# Altium schematic sheet Actel_CoreMP7_UART.SchDoc
size B; DocumentNumber: 1; SheetNumber: 1; SheetTotal: 1
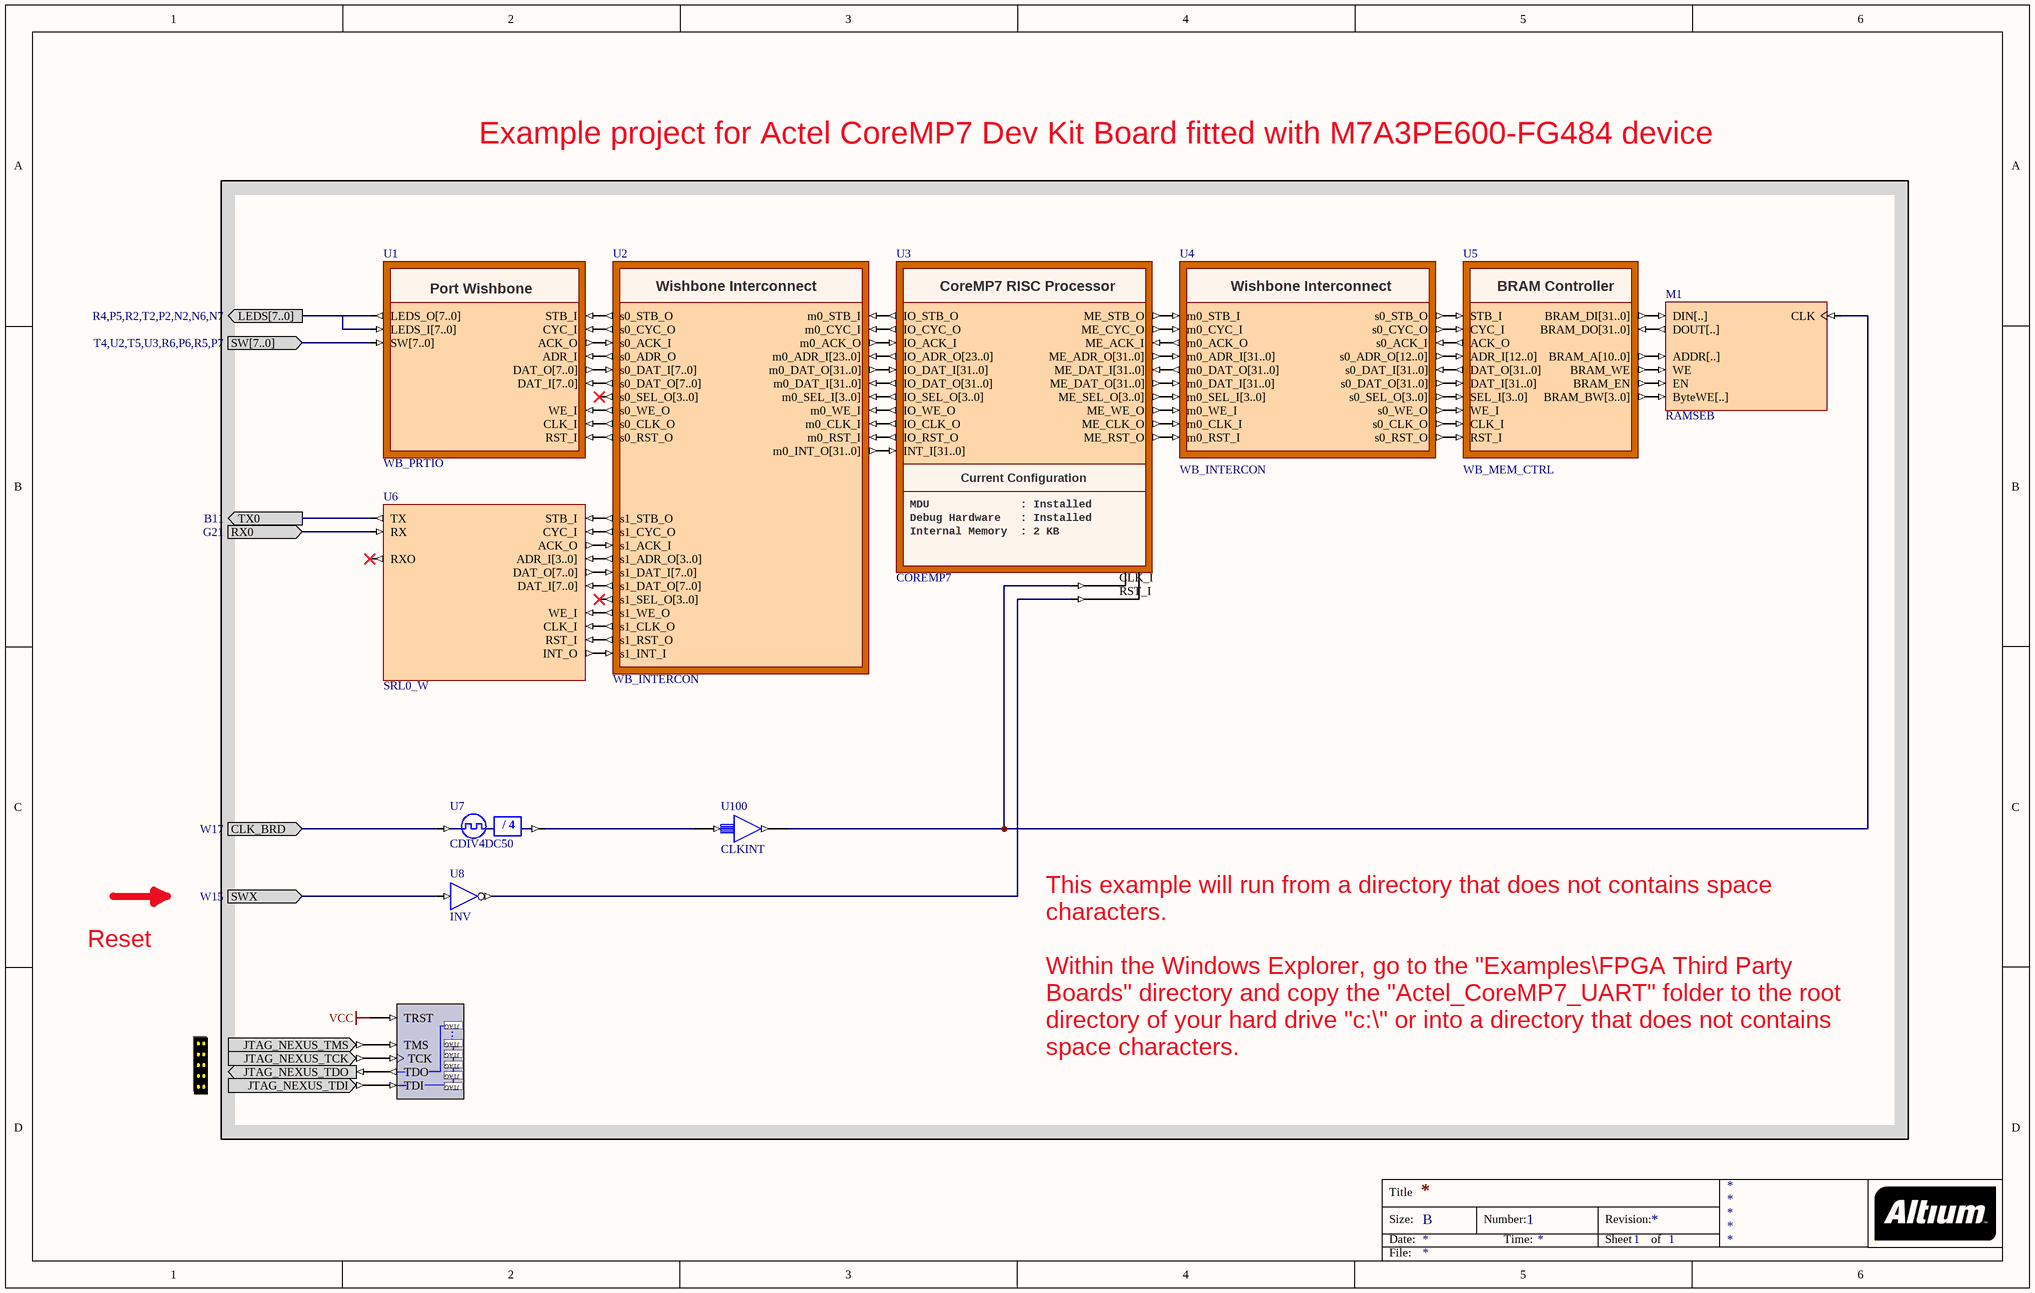
[diagram p0: Actel_CoreMP7_UART.SchDoc]

## Parts
?  NEXUS_JTAG_CONNECTOR  (value not drawn)
M1  RAMSEB
NEXUS_JTAG_PORT  NEXUS_JTAG_PORT  (value not drawn)
U1  WB_PRTIO
U2  WB_INTERCON
U3  COREMP7
U4  WB_INTERCON
U5  WB_MEM_CTRL
U6  SRL0_W
U7  CDIV4DC50
U8  INV
U100  CLKINT

## Ports
CLK_BRD (in, see W17), LEDS[7..0] (out, see R4,P5,R2,T2,P2,N2,N6,N7), RX0 (in, see G21), SW[7..0] (in, see T4,U2,T5,U3,R6,P6,R5,P7), SWX (in, see W15), TX0 (out, see B11)

## Nets
VCC: NEXUS_JTAG_PORT.TRST
CLK_BRD: U7.CLKIN ; port CLK_BRD
LEDS[7..0]: U1.LEDS_I[7..0] U1.LEDS_O[7..0] ; port LEDS[7..0]
RX0: U6.RX ; port RX0
SW[7..0]: U1.SW[7..0] ; port SW[7..0]
SWX: U8.I ; port SWX
TX0: U6.TX ; port TX0
Net?_JTAG_NEXUS_TCK: ?.JTAG_NEXUS_TCK NEXUS_JTAG_PORT.TCK
Net?_JTAG_NEXUS_TDI: ?.JTAG_NEXUS_TDI NEXUS_JTAG_PORT.TDI
Net?_JTAG_NEXUS_TDO: ?.JTAG_NEXUS_TDO NEXUS_JTAG_PORT.TDO
Net?_JTAG_NEXUS_TMS: ?.JTAG_NEXUS_TMS NEXUS_JTAG_PORT.TMS
NetM1_ADDR[..]: M1.ADDR[..] U5.BRAM_A[10..0]
NetM1_ByteWE[..]: M1.ByteWE[..] U5.BRAM_BW[3..0]
NetM1_CLK: M1.CLK U3.CLK_I U100.Y
NetM1_DIN[..]: M1.DIN[..] U5.BRAM_DI[31..0]
NetM1_DOUT[..]: M1.DOUT[..] U5.BRAM_DO[31..0]
NetM1_EN: M1.EN U5.BRAM_EN
NetM1_WE: M1.WE U5.BRAM_WE
NetU1_ACK_O: U1.ACK_O U2.s0_ACK_I
NetU1_ADR_I: U1.ADR_I U2.s0_ADR_O
NetU1_CLK_I: U1.CLK_I U2.s0_CLK_O
NetU1_CYC_I: U1.CYC_I U2.s0_CYC_O
NetU1_DAT_I[7..0]: U1.DAT_I[7..0] U2.s0_DAT_O[7..0]
NetU1_DAT_O[7..0]: U1.DAT_O[7..0] U2.s0_DAT_I[7..0]
NetU1_RST_I: U1.RST_I U2.s0_RST_O
NetU1_STB_I: U1.STB_I U2.s0_STB_O
NetU1_WE_I: U1.WE_I U2.s0_WE_O
NetU2_m0_ACK_O: U2.m0_ACK_O U3.IO_ACK_I
NetU2_m0_ADR_I[23..0]: U2.m0_ADR_I[23..0] U3.IO_ADR_O[23..0]
NetU2_m0_CLK_I: U2.m0_CLK_I U3.IO_CLK_O
NetU2_m0_CYC_I: U2.m0_CYC_I U3.IO_CYC_O
NetU2_m0_DAT_I[31..0]: U2.m0_DAT_I[31..0] U3.IO_DAT_O[31..0]
NetU2_m0_DAT_O[31..0]: U2.m0_DAT_O[31..0] U3.IO_DAT_I[31..0]
NetU2_m0_INT_O[31..0]: U2.m0_INT_O[31..0] U3.INT_I[31..0]
NetU2_m0_RST_I: U2.m0_RST_I U3.IO_RST_O
NetU2_m0_SEL_I[3..0]: U2.m0_SEL_I[3..0] U3.IO_SEL_O[3..0]
NetU2_m0_STB_I: U2.m0_STB_I U3.IO_STB_O
NetU2_m0_WE_I: U2.m0_WE_I U3.IO_WE_O
NetU2_s1_ACK_I: U2.s1_ACK_I U6.ACK_O
NetU2_s1_ADR_O[3..0]: U2.s1_ADR_O[3..0] U6.ADR_I[3..0]
NetU2_s1_CLK_O: U2.s1_CLK_O U6.CLK_I
NetU2_s1_CYC_O: U2.s1_CYC_O U6.CYC_I
NetU2_s1_DAT_I[7..0]: U2.s1_DAT_I[7..0] U6.DAT_O[7..0]
NetU2_s1_DAT_O[7..0]: U2.s1_DAT_O[7..0] U6.DAT_I[7..0]
NetU2_s1_INT_I: U2.s1_INT_I U6.INT_O
NetU2_s1_RST_O: U2.s1_RST_O U6.RST_I
NetU2_s1_STB_O: U2.s1_STB_O U6.STB_I
NetU2_s1_WE_O: U2.s1_WE_O U6.WE_I
NetU3_ME_ACK_I: U3.ME_ACK_I U4.m0_ACK_O
NetU3_ME_ADR_O[31..0]: U3.ME_ADR_O[31..0] U4.m0_ADR_I[31..0]
NetU3_ME_CLK_O: U3.ME_CLK_O U4.m0_CLK_I
NetU3_ME_CYC_O: U3.ME_CYC_O U4.m0_CYC_I
NetU3_ME_DAT_I[31..0]: U3.ME_DAT_I[31..0] U4.m0_DAT_O[31..0]
NetU3_ME_DAT_O[31..0]: U3.ME_DAT_O[31..0] U4.m0_DAT_I[31..0]
NetU3_ME_RST_O: U3.ME_RST_O U4.m0_RST_I
NetU3_ME_SEL_O[3..0]: U3.ME_SEL_O[3..0] U4.m0_SEL_I[3..0]
NetU3_ME_STB_O: U3.ME_STB_O U4.m0_STB_I
NetU3_ME_WE_O: U3.ME_WE_O U4.m0_WE_I
NetU3_RST_I: U3.RST_I U8.O
NetU4_s0_ACK_I: U4.s0_ACK_I U5.ACK_O
NetU4_s0_ADR_O[12..0]: U4.s0_ADR_O[12..0] U5.ADR_I[12..0]
NetU4_s0_CLK_O: U4.s0_CLK_O U5.CLK_I
NetU4_s0_CYC_O: U4.s0_CYC_O U5.CYC_I
NetU4_s0_DAT_I[31..0]: U4.s0_DAT_I[31..0] U5.DAT_O[31..0]
NetU4_s0_DAT_O[31..0]: U4.s0_DAT_O[31..0] U5.DAT_I[31..0]
NetU4_s0_RST_O: U4.s0_RST_O U5.RST_I
NetU4_s0_SEL_O[3..0]: U4.s0_SEL_O[3..0] U5.SEL_I[3..0]
NetU4_s0_STB_O: U4.s0_STB_O U5.STB_I
NetU4_s0_WE_O: U4.s0_WE_O U5.WE_I
NetU7_CLKDV: U7.CLKDV U100.A

Not connected (* = marked no-connect by the designer): U2 s0_SEL_O[3..0]* s1_SEL_O[3..0]*; U6 RXO*

## Notes on the sheet
- Example project for Actel CoreMP7 Dev Kit Board fitted with M7A3PE600-FG484 device
- Reset
- This example will run from a directory that does not contains space characters.
  Within the Windows Explorer, go to the "Examples\FPGA Third Party Boards" directory and copy the "Actel_CoreMP7_UART" folder to the root directory of your hard drive "c:\" or into a directory that does not contains space characters.
- Title
- Size:
- Date:
- B
- Number:
- Time:
- Revision:
- Sheet
- of
- File:
- (in symbol CDIV4DC50) / 4
- (in symbol COREMP7) Current Configuration; MDU              : Installed; Debug Hardware   : Installed; Internal Memory  : 2 KB
- (in symbol NEXUS_JTAG_PORT) .
- (in symbol WB_INTERCON) Wishbone Interconnect
- (in symbol WB_MEM_CTRL) BRAM Controller
- (in symbol WB_PRTIO) Port Wishbone

## Library data of the parts
? = NEXUS_JTAG_CONNECTOR: JTAG Port; PortComponent: True; Published: 19-Nov-2003; Publisher: Altium Limited; HelpURL: TR0102 NanoBoard Technical Reference Manual - NB1.pdf#page=33
M1 = RAMSEB: Single Port Random Access Memory With Enable, Byte Write Enable; Memory_Depth: DefinedBy=ADDR; Memory_Type: RAM_SinglePortBlock; Memory_Width: DefinedBy=DIN; Memory_ClockEdge: Rising; Nexus_Core: Memory_Program; Memory_EnablePin: True; SubClass: RAM; Published: 12-Jan-2005; Publisher: Altium Limited; LastRevisionNo: 1.00.00; HelpURL: CR0118 FPGA Generic Library Guide.pdf#page=419; FunctionalClass: Memory; Memory_ByteWrites: True
NEXUS_JTAG_PORT = NEXUS_JTAG_PORT: Soft Nexus-Chain Connector; NEXUS_JTAG_CONNECTOR: True; FunctionalClass: JTAG; Published: 29-Jan-2004; Publisher: Altium Limited; LastRevisionNo: 1.00.00; HelpURL: CR0118 FPGA Generic Library Guide.pdf#page=405
U1 = WB_PRTIO: Configurable Port Wishbone; ConfigurationParameters: {}Version[2.0]{}Signal0Name[LEDS_]{}Signal0Type[In/Out]{}Signal0BusString[{1}7..0{2}]{}Signal0Address[0]{}Signal0SpaceAfter[0]{}Signal1Name[SW]{}Signal1Type[In]{}Signal1BusString[{1}7..0{2}]{}Signal1Address[1]{}Signal1SpaceAfter[0]{}; ComponentLink1Description: Core &Resource Usage; ComponentLink1URL: CR0139 FPGA Peripheral Resource Usage.pdf#page=74; HelpURL: CR0154 WB_PRTIO Configurable Wishbone Parallel Port Unit.pdf; LastRevisionNo: 1.00.00; Published: 9-Dec-2004; Publisher: Altium Limited; ConfiguratorName: WB_PRTIO
U2 = WB_INTERCON: Configurable Wishbone Interconnect; ConfigurationParameters: {}Version[1.0]{}UnusedInterrupts[1]{}MasterAddressBits[1]{}Name0[GPIO]{}Kind0[0]{}SpaceAfter0[5]{}Address_Base0[0]{}Address_Bits0[1]{}Address_Mode0[1]{}Address_DecodeWidth0[8]{}DataWidth0[2]{}UsedInterrupts0[ ]{}Name1[UART]{}Kind1[0]{}SpaceAfter1[4]{}Address_Base1[1048576]{}Address_Bits1[4]{}Address_Mode1[1]{}Address_DecodeWidth1[8]{}DataWidth1[2]{}UsedInterrupts1[0]; ComponentLink1Description: Core &Resource Usage; ComponentLink1URL: CR0139 FPGA Peripheral Resource Usage.pdf#page=56; HelpURL: CR0150 WB_INTERCON Configurable Wishbone Interconnect.pdf; LastRevisionNo: 1.00.00; Published: 9-Dec-2004; Publisher: Altium Limited; ConfiguratorName: WB_INTERCON
U3 = COREMP7: CoreMP7 RISC Processor; Nexus_JTAG_Device: True; Nexus_Core: Processor_OCDS; Nexus_JTAG_Order: 0; ConfigurationParameters: {}Version[1.0]{}Option_Processor[8]{}Option_Memory[1]{}Option_MDU[0]{}Option_OCDS[0]{}Option_Shifter[0]{}Option_InterruptCount[32]{}Option_DebugWhenReset[0]{}; ConfiguratorName: FPGA_MCU32; Memory_Configuration: Record[PERIPHERAL]{}ComponentDesignator[GPIO]{}Memory_Depth[0x0002]{}Memory_UsageType[peripheral]{}ProgramDownloadAddress[0xFF000000]{}Memory_BusType[ARM:local_bus]{}Memory_Mau[8]{}Memory_MatchedComponent[]{}Memory_Description[U2]{}Memory_FillBitPattern[]{}Memory_Interrupts[]{n}Record[PERIPHERAL]{}ComponentDesignator[UART]{}Memory_Depth[0x0010]{}Memory_UsageType[peripheral]{}ProgramDownloadAddress[0xFF100000]{}Memory_BusType[ARM:local_bus]{}Memory_Mau[8]{}Memory_MatchedComponent[]{}Memory_Description[U2]{}Memory_FillBitPattern[]{}Memory_Interrupts[0]{n}Record[CODE_EXPORT]{}ExportType[1]{n}Record[NEXUS_CORE]{}ComponentDesignator[irom]{}Memory_Depth[2k]{}Memory_UsageType[rom]{}ProgramDownloadAddress[0x00000000]{}Memory_BusType[ARM:local_bus]{}Memory_Mau[8]{}Memory_MatchedComponent[]{}Memory_Description[]{}Memory_FillBitPattern[]{}Memory_Interrupts[]{n}Record[NEXUS_CORE]{}ComponentDesignator[xrom]{}Memory_Depth[5k]{}Memory_UsageType[rom]{}ProgramDownloadAddress[0x1000000]{}Memory_BusType[ARM:local_bus]{}Memory_Mau[8]{}Memory_MatchedComponent[]{}Memory_Description[U4]{}Memory_FillBitPattern[]{}Memory_Interrupts[]{n}Record[NEXUS_CORE]{}ComponentDesignator[xram]{}Memory_Depth[3k]{}Memory_UsageType[ram]{}ProgramDownloadAddress[0x01001400]{}Memory_BusType[ARM:local_bus]{}Memory_Mau[8]{}Memory_MatchedComponent[]{}Memory_Description[]{}Memory_FillBitPattern[]{}Memory_Interrupts[]{n}; IncludeInDSF: __COREMP7__; ProgramLogicalTopAddress: 0; ComponentLink1Description: Core &Resource Usage; ComponentLink1URL: CR0140 FPGA Processor Resource Usage.pdf#page=2; LastRevisionNo: 1.00.00; Published: 03-May-2007; Publisher: Altium Limited; ComponentLink2Description: Embedded &Tools Guide; ComponentLink2URL: GU0116 Using the ARM Embedded Tools.pdf; ComponentLink3Description: Embedded T&echnical References; ComponentLink3URL: TR0131 ARM Embedded Tools Reference.pdf; ComponentLink4Description: Manufacturers D&ata Sheet; ComponentLink4URL: http://www.actel.com/documents/CoreMP7_DS.pdf
U4 = WB_INTERCON: Configurable Wishbone Interconnect; ConfigurationParameters: {}Version[1.0]{}UnusedInterrupts[2]{}MasterAddressBits[0]{}Name0[BRAM]{}Kind0[2]{}SpaceAfter0[4]{}Address_Base0[16777216]{}Address_Bits0[13]{}Address_Mode0[1]{}Address_DecodeWidth0[8]{}DataWidth0[0]{}UsedInterrupts0[ ]; ComponentLink1Description: Core &Resource Usage; ComponentLink1URL: CR0139 FPGA Peripheral Resource Usage.pdf#page=56; HelpURL: CR0150 WB_INTERCON Configurable Wishbone Interconnect.pdf; LastRevisionNo: 1.00.00; Published: 9-Dec-2004; Publisher: Altium Limited; ConfiguratorName: WB_INTERCON
U5 = WB_MEM_CTRL: Configurable Memory Controller; ConfigurationParameters: {}Version[1.0]{}Option_MemoryType[Block RAM]{}Option_MemorySize[8 KB (2K x 32-bit)]{}Option_Layout[1 x 32-bit Wide Device]{}Option_Read[2]{}Option_WriteSetup[1]{}Option_WritePulse[1]{}Option_WriteHold[1]{}Option_SdramKeepRowOpen[0]{}Option_SdramClock[100]{}Option_SdramWriteRecovery[4]{}Option_SdramAutoRefresh[16]{}Option_SdramActiveToReadWrite[8]{}Option_SdramPrecharge[16]{}Option_SdramCasLatency[2]{}; ComponentLink1Description: Core &Resource Usage; ComponentLink1URL: CR0139 FPGA Peripheral Resource Usage.pdf#page=62; HelpURL: CR0152 WB_MEM_CTRL Configurable Wishbone Memory Controller.pdf; LastRevisionNo: 1.00.00; Published: 9-Dec-2004; Publisher: Altium Limited; ConfiguratorName: WB_MEM_CTRL
U6 = SRL0_W: Serial 0 Wishbone; UseInDSF: True; Published: 9-Dec-2004; Publisher: Altium Limited; ComponentLink1Description: Core &Resource Usage; ComponentLink1URL: CR0139 FPGA Peripheral Resource Usage.pdf#page=43; HelpURL: CR0111 SRL0 Serial Port Unit.pdf; LastRevisionNo: 1.00.00
U7 = CDIV4DC50: Clock Divider by 4 with 50% Duty Cycle Output; XilinxEquivalent: CLK_DIV4; DivisorRate: 4; DutyCycle: 50; ArchiveName: GENERIC; VHDLIB_SIM: GENERIC_LIB; Published: 29-Jan-2004; Publisher: Altium Limited; LastRevisionNo: 1.00.00; HelpURL: CR0118 FPGA Generic Library Guide.pdf#page=143; ComponentLink1URL: CR0127 FPGA Clock Divider Resource Usage.pdf#page=6; ComponentLink1Description: Core &Resource Usage; FunctionalClass: Clock Divider
U8 = INV: Inverter; FunctionalClass: Logic Primitive; ArchiveName: GENERIC; VHDLIB_SIM: GENERIC_LIB; Published: 29-Jan-2004; Publisher: Altium Limited; XilinxEquivalent: INV; LastRevisionNo: 1.00.00; HelpURL: CR0118 FPGA Generic Library Guide.pdf#page=291; ComponentLink1URL: CR0136 FPGA Logic Primitive Resource Usage.pdf#page=61; ComponentLink1Description: Core &Resource Usage; SubClass: INV
U100 = CLKINT: 2.5 Volt CMOS input levels, low drive strength, low slew rate; FPGAVendor: Actel; Published: 25-Oct-2005; Publisher: Altium Limited; HelpURL: http://www.actel.com/documents/pa3_libguide.pdf